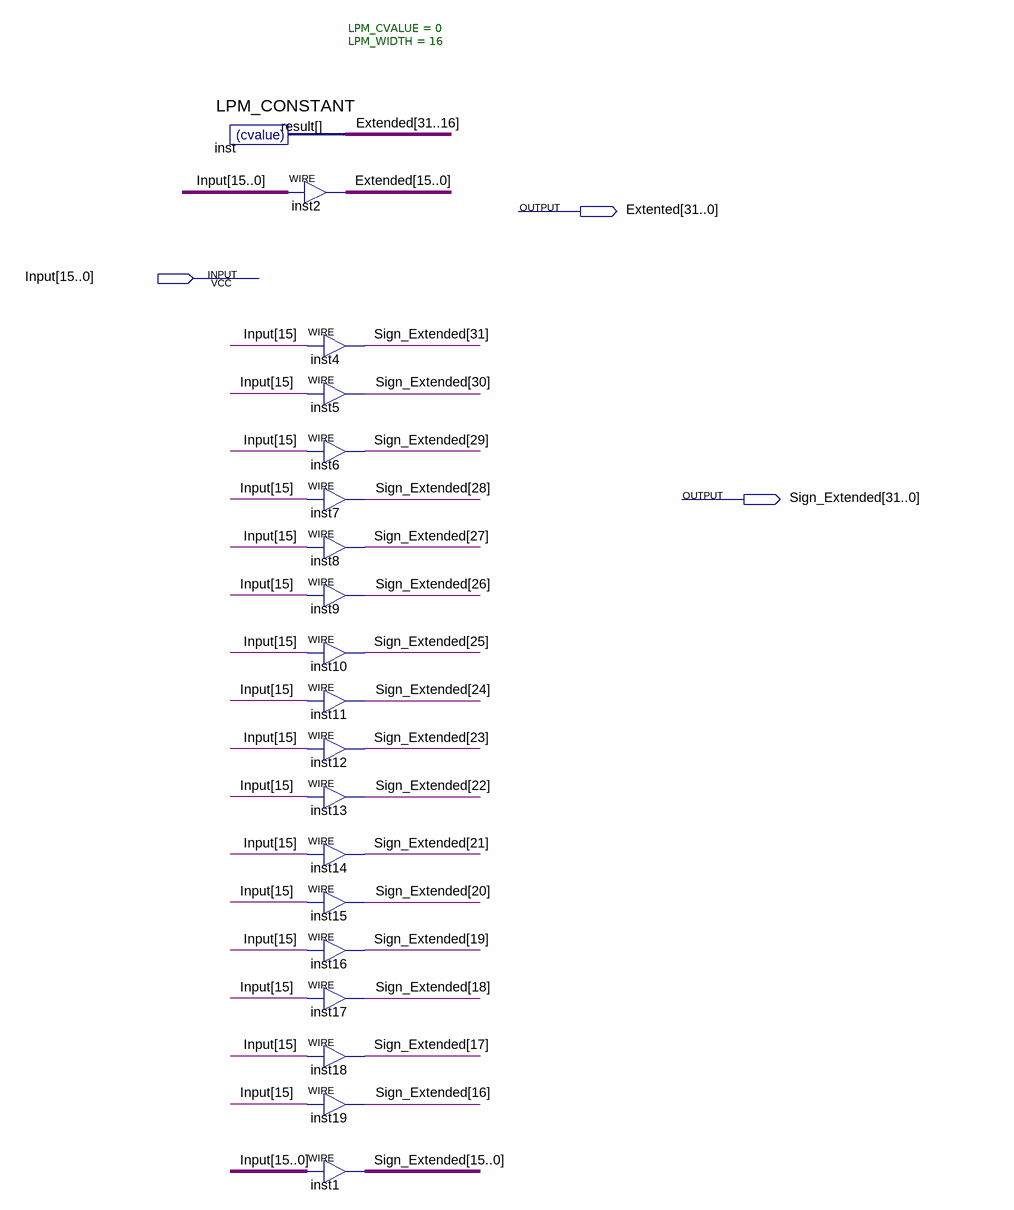
[diagram p0: schematic sheet]
// Quartus schematic Extender.bdf as structural Verilog: 19 symbols, 3 pins
module Extender (
  input  [15:0] Input,
  output [31:0] Extented,
  output [31:0] Sign_Extended
);

  wire [31:0] Extended;

  LPM_CONSTANT #(.LPM_CVALUE(0), .LPM_WIDTH(16)) inst (.result(Extended[31:16]));
  assign Extended[15:0] = Input;  // WIRE inst2
  assign Sign_Extended[31] = Input[15];  // WIRE inst4
  assign Sign_Extended[30] = Input[15];  // WIRE inst5
  assign Sign_Extended[29] = Input[15];  // WIRE inst6
  assign Sign_Extended[28] = Input[15];  // WIRE inst7
  assign Sign_Extended[27] = Input[15];  // WIRE inst8
  assign Sign_Extended[26] = Input[15];  // WIRE inst9
  assign Sign_Extended[25] = Input[15];  // WIRE inst10
  assign Sign_Extended[24] = Input[15];  // WIRE inst11
  assign Sign_Extended[23] = Input[15];  // WIRE inst12
  assign Sign_Extended[22] = Input[15];  // WIRE inst13
  assign Sign_Extended[21] = Input[15];  // WIRE inst14
  assign Sign_Extended[20] = Input[15];  // WIRE inst15
  assign Sign_Extended[19] = Input[15];  // WIRE inst16
  assign Sign_Extended[18] = Input[15];  // WIRE inst17
  assign Sign_Extended[17] = Input[15];  // WIRE inst18
  assign Sign_Extended[16] = Input[15];  // WIRE inst19
  assign Sign_Extended[15:0] = Input;  // WIRE inst1
endmodule
